# EAGLE design Rusnak2 (EAGLE 5.11)
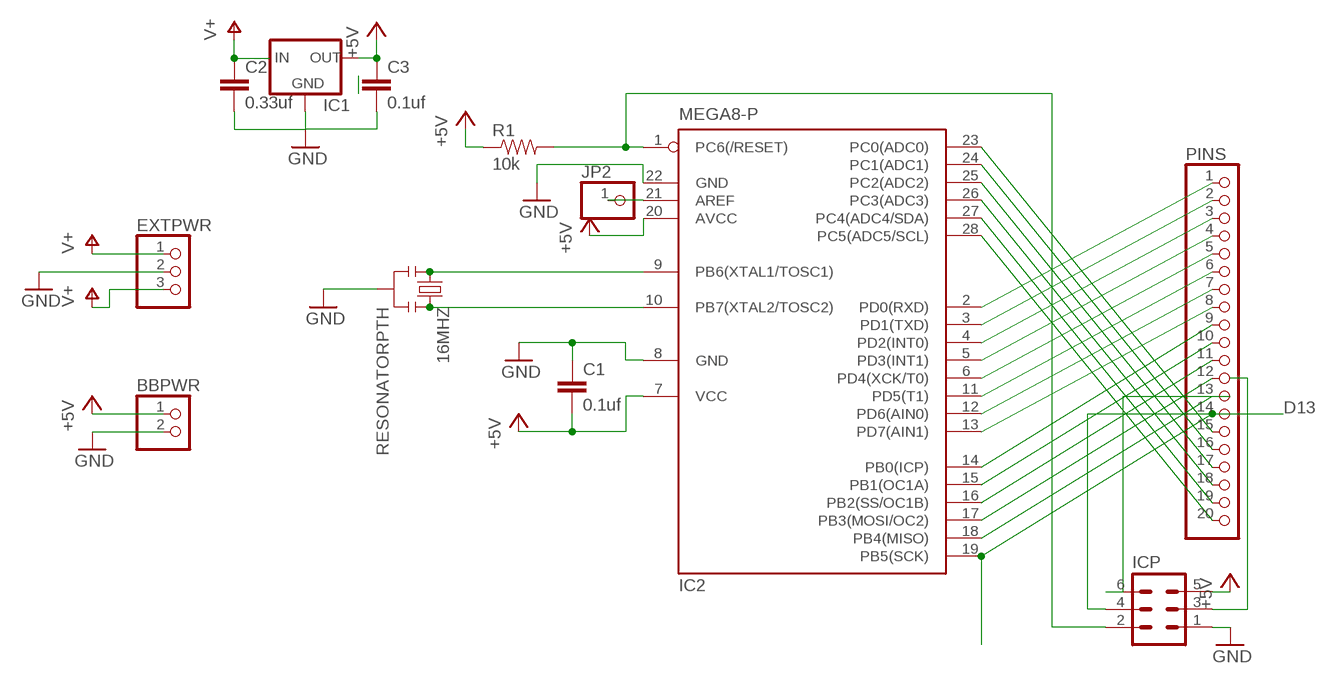
[diagram p0: schematic, sheet 1]

## Parts
16MHZ  RESONATORPTH  [RESONATOR-PTH]
BBPWR  PINHD-1X2  [1X02]
C1  0.1uf  CAP0402-CAP  [0402-CAP]
C2  0.33uf  CAP0402-CAP  [0402-CAP]
C3  0.1uf  CAP0402-CAP  [0402-CAP]
EXTPWR  PINHD-1X3  [1X03]
IC1  V_REG_78XX-TO-220  [TO-220-ALT]
IC2  MEGA8-P  [DIL28-3]
ICP  MA03-2  [MA03-2]
JP2  PINHD-1X1  [1X01]
PINS  PINHD-1X20  [1X20]
R1  10k  RESISTOR0402-RES  [0402-RES]

## Nets
+5V: BBPWR.1 C1.2 C3.1 IC1.OUT IC2.7(VCC) IC2.20(AVCC) ICP.5 R1.1
D0: IC2.2(PD0(RXD)) PINS.1
D13: IC2.19(PB5(SCK)) ICP.4 PINS.14
GND: 16MHZ.2 BBPWR.2 C1.1 C2.2 C3.2 EXTPWR.2 IC1.GND IC2.8(GND) IC2.22(GND) ICP.1
N$1: IC2.1(PC6(/RESET)) ICP.2 R1.2
N$2: IC2.21(AREF) JP2.1
N$4: 16MHZ.3 IC2.10(PB7(XTAL2/TOSC2))
N$5: 16MHZ.1 IC2.9(PB6(XTAL1/TOSC1))
N$6: IC2.28(PC5(ADC5/SCL)) PINS.20
N$7: IC2.27(PC4(ADC4/SDA)) PINS.19
N$8: IC2.26(PC3(ADC3)) PINS.18
N$9: IC2.25(PC2(ADC2)) PINS.17
N$10: IC2.24(PC1(ADC1)) PINS.16
N$11: IC2.23(PC0(ADC0)) PINS.15
N$13: IC2.3(PD1(TXD)) PINS.2
N$14: IC2.4(PD2(INT0)) PINS.3
N$15: IC2.5(PD3(INT1)) PINS.4
N$16: IC2.6(PD4(XCK/T0)) PINS.5
N$17: IC2.11(PD5(T1)) PINS.6
N$18: IC2.12(PD6(AIN0)) PINS.7
N$19: IC2.13(PD7(AIN1)) PINS.8
N$20: IC2.14(PB0(ICP)) PINS.9
N$21: IC2.15(PB1(OC1A)) PINS.10
N$22: IC2.16(PB2(SS/OC1B)) PINS.11
N$23: IC2.17(PB3(MOSI/OC2)) PINS.12
N$24: IC2.18(PB4(MISO)) PINS.13
N$27: ICP.3
N$28: ICP.6
V+: C2.1 EXTPWR.1 EXTPWR.3
Unconnected: IC1.IN

## Library data of the parts
16MHZ = SparkFun:RESONATOR: Resonator Small SMD resonator. This is the itty bitty 10/20MHz resonators with built in caps. CSTCE10M0G55 and CSTCE20M0V53. Footprint has been reviewed closely but hasn't been tested yet.
BBPWR = pinhead:PINHD-1X2: PIN HEADER
C1-C3 = SparkFun:CAP: Capacitor Standard 0603 ceramic capacitor, and 0.1" leaded capacitor.
EXTPWR = pinhead:PINHD-1X3: PIN HEADER
IC1 = SparkFun:V_REG_78XX: Voltage Regulator Standard 7805 5V regulator. IGO (Input Ground Output). Spark Fun Electronics SKU : COM-00107
IC2 = atmel:MEGA8-P: MICROCONTROLLER 8 Kbytes FLASH, 1 kbytes SRAM, 512 bytes EEPROM, USART, 4-channel 10 bit ADC, 2-channel 8 bit ADC Pin compatible with Atmega48, ATMega88, ATMega168 Source: avr.lbr; OC_FARNELL: unknown; OC_NEWARK: unknown
ICP = con-lstb:MA03-2: PIN HEADER; OC_FARNELL: unknown; OC_NEWARK: unknown
JP2 = pinhead:PINHD-1X1: PIN HEADER
PINS = pinhead:PINHD-1X20: PIN HEADER
R1 = SparkFun:RESISTOR: Resistor Basic schematic elements and footprints for 0603, 1206, and PTH resistors.

## Board
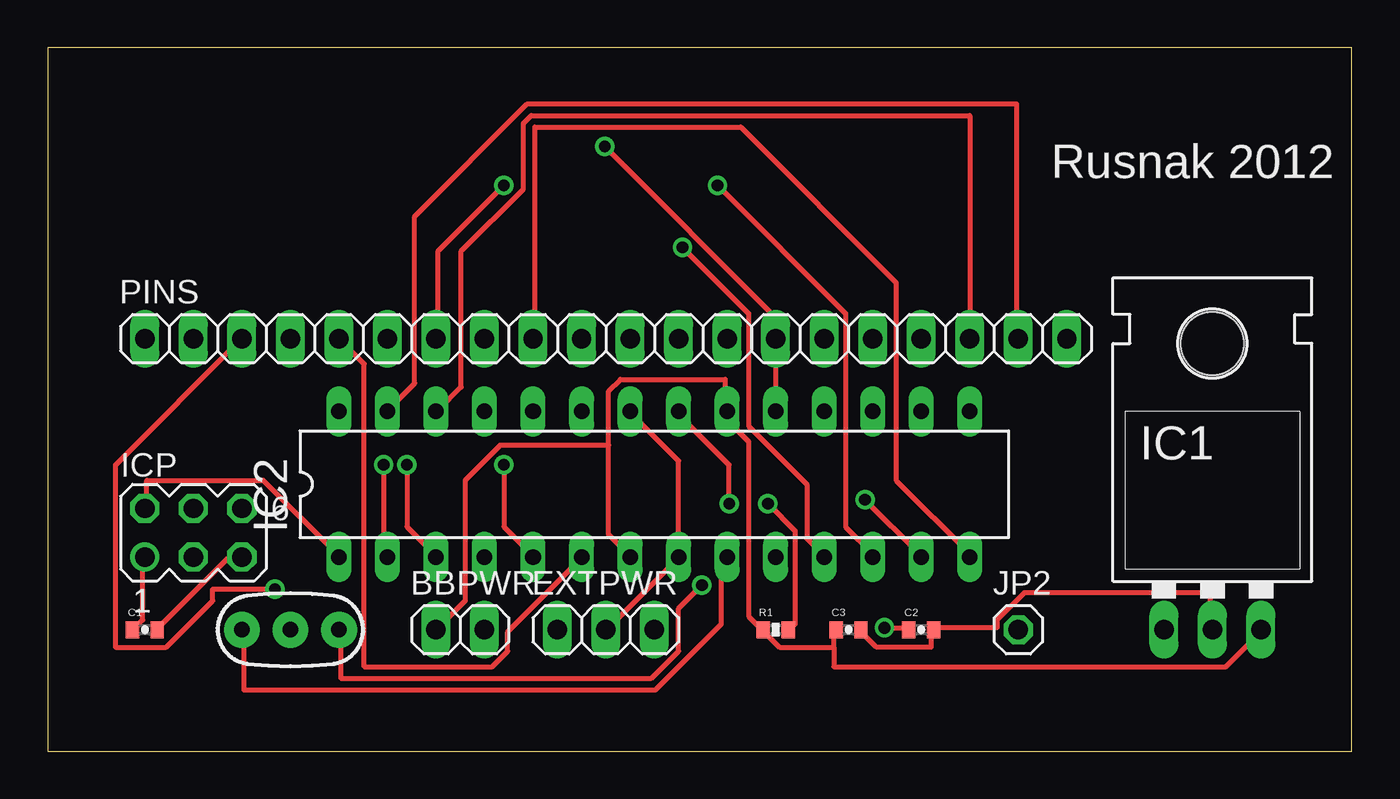
[diagram p1: board, top side]
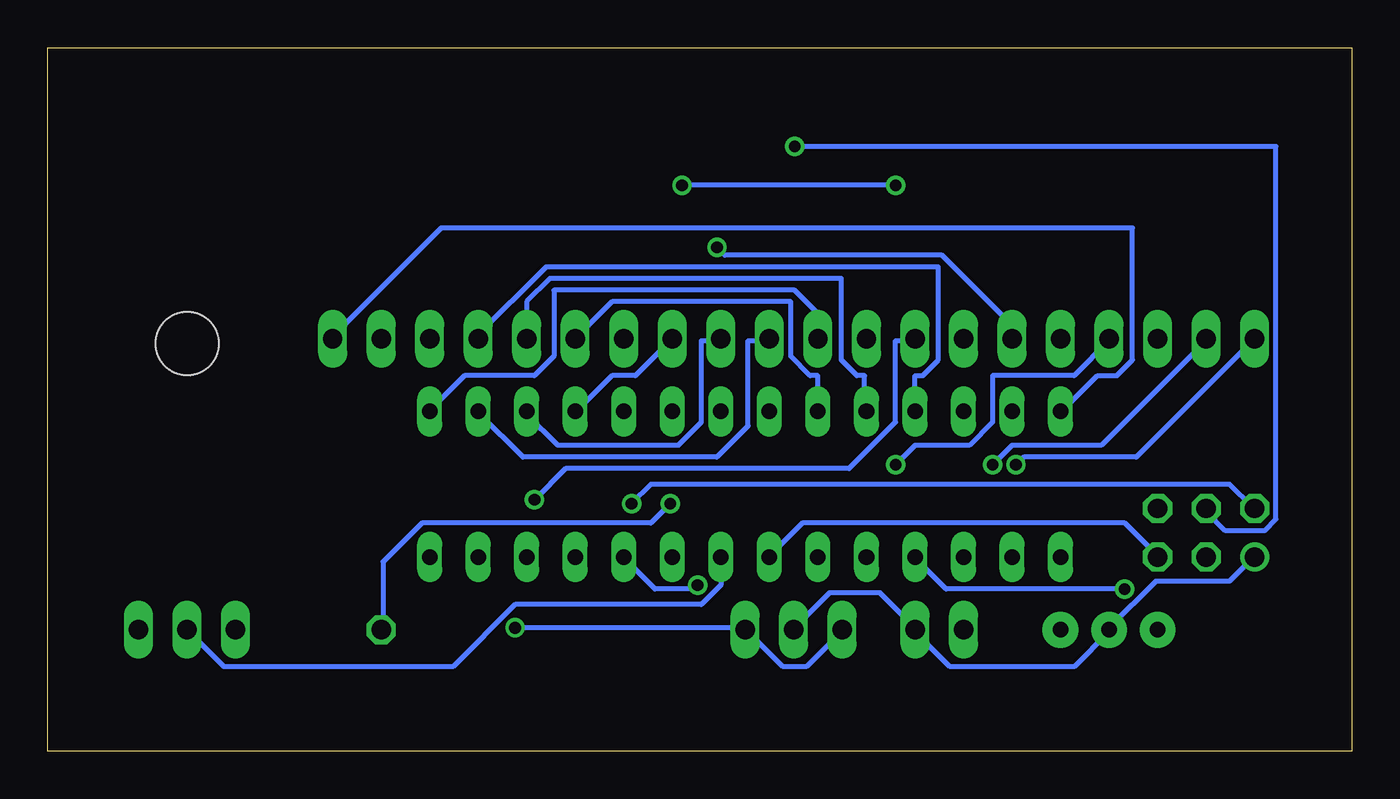
[diagram p2: board, bottom side, seen from below]

Size 68.25 x 36.82 mm. Coordinates in mm from the lower left corner, seen from the top.
Outline: 0,0 68.25,0 68.25,36.82 0,36.82 0,0
Copper layers (1*16): Top 0.035mm / dielectric 1.5mm / Bottom 0.035mm
Design rules "default": minimum track width 10mil, minimum drill 24mil, track to track 8mil, track to pad 8mil, pad to pad 8mil, via to via 8mil, smd to smd 8mil, copper to edge 40mil, drill to drill 8mil, minimum pad ring 10mil, minimum via ring 8mil, stop-mask expansion 4mil, vias tented up to drill 0mil, thermal gap 10mil

### Footprints (pad centres in the part's own frame; a part is rotated, then mirrored left to right if it is on the bottom)
RESONATOR-PTH = drill 0.8 pad 1.88 round: 1 -2.54,0; 2 0,0; 3 2.54,0
1X02 = drill 1.016 long: 1 -1.27,0; 2 1.27,0
0402-CAP = smd 0.7 x 0.9: 1 -0.65,0; 2 0.65,0
1X03 = drill 1.016 long: 1 -2.54,0; 2 0,0; 3 2.54,0
TO-220-ALT = drill 1.016 long: GND 0,-3.81; IN -2.54,-3.81; OUT 2.54,-3.81 | hole 3.302: 0,11.176
DIL28-3 = drill 0.813 long: 1 -16.51,-3.81; 2 -13.97,-3.81; 3 -11.43,-3.81; 4 -8.89,-3.81; 5 -6.35,-3.81; 6 -3.81,-3.81; 7 -1.27,-3.81; 8 1.27,-3.81; 9 3.81,-3.81; 10 6.35,-3.81; 11 8.89,-3.81; 12 11.43,-3.81; 13 13.97,-3.81; 14 16.51,-3.81; 15 16.51,3.81; 16 13.97,3.81; 17 11.43,3.81; 18 8.89,3.81; 19 6.35,3.81; 20 3.81,3.81; 21 1.27,3.81; 22 -1.27,3.81; 23 -3.81,3.81; 24 -6.35,3.81; 25 -8.89,3.81; 26 -11.43,3.81; 27 -13.97,3.81; 28 -16.51,3.81
MA03-2 = drill 1.016 round: 1 -2.54,-1.27 | drill 1.016 octagon: 2 -2.54,1.27; 3 0,-1.27; 4 0,1.27; 5 2.54,-1.27; 6 2.54,1.27
1X01 = drill 1.016 octagon: 1 0,0
1X20 = drill 1.016 long: 1 -24.13,0; 2 -21.59,0; 3 -19.05,0; 4 -16.51,0; 5 -13.97,0; 6 -11.43,0; 7 -8.89,0; 8 -6.35,0; 9 -3.81,0; 10 -1.27,0; 11 1.27,0; 12 3.81,0; 13 6.35,0; 14 8.89,0; 15 11.43,0; 16 13.97,0; 17 16.51,0; 18 19.05,0; 19 21.59,0; 20 24.13,0
0402-RES = smd 0.7 x 0.9: 1 -0.65,0; 2 0.65,0

### Placement (x,y rotation side)
16MHZ  12.7,6.35 0 top
BBPWR  21.59,6.35 0 top
C1  5.08,6.35 0 top
C2  45.72,6.35 0 top
C3  41.91,6.35 0 top
EXTPWR  29.21,6.35 0 top
IC1  60.96,10.16 0 top
IC2  31.75,13.97 0 top
ICP  7.62,11.43 0 top
JP2  50.8,6.35 0 top
PINS  29.21,21.59 0 top
R1  38.1,6.35 0 top

### Tracks (layer width: path | path; a pad name or v marks a point on that pad's centre or on a via)
+5V
  Top 0.254: C1.2 5.79,6.45 9.45,10.11 10.06,10.11 ICP.5 | 41.15,5.44 38.3,5.44 37.49,6.25 R1.1 37.29,6.45 36.68,7.06 36.68,16.2 35.66,17.22 35.66,17.63 IC2.20 35.46,17.83 35.46,19.46 29.97,19.46 29.36,18.85 29.36,16 | 41.15,5.44 41.15,6.25 C3.1 | 29.36,16 29.36,11.33 30.38,10.31 IC2.7 | 29.36,16 23.67,16 21.84,14.17 21.84,7.87 BBPWR.1 | 41.15,5.44 41.15,4.42 61.67,4.42 63.5,6.25 IC1.OUT
  Bottom 0.254: ICP.5 10.26,10.31 11.89,11.94 28.75,11.94 30.38,10.31 IC2.7
D0  (via drill 0.61)
  Top 0.254: v17.58,14.99 17.58,10.52 17.78,10.31 IC2.2
  Bottom 0.254: v17.58,14.99 17.17,15.39 11.28,15.39 PINS.1
D13  (via drill 0.61)
  Top 0.254: IC2.19 PINS.14 38.1,22.71 v29.16,31.65
  Bottom 0.254: v29.16,31.65 3.96,31.65 3.96,12.14 4.57,11.53 6.6,11.53 7.62,12.55 ICP.4
GND
  Top 0.254: C3.2 42.57,6.25 43.38,5.44 46.23,5.44 46.23,6.25 C2.2 46.43,6.45 49.68,6.45 49.68,6.86 51.1,8.28 60.86,8.28 60.86,6.45 IC1.GND | C1.1 4.57,6.45 4.98,6.86 4.98,10.11 ICP.1 | EXTPWR.2 29.36,6.45 33.02,10.11 IC2.8 33.02,15.19 30.58,17.63 IC2.22
  Bottom 0.254: ICP.1 5.18,10.11 6.4,8.89 10.26,8.89 12.7,6.45 16MHZ.2 12.7,6.25 14.53,4.42 21.03,4.42 22.86,6.25 BBPWR.2 22.86,6.45 24.69,8.28 27.33,8.28 29.16,6.45 EXTPWR.2 | IC1.GND 59.03,4.42 47.04,4.42 43.79,7.67 34.04,7.67 33.02,8.69 IC2.8
N$1  (via drill 0.61)
  Top 0.254: v37.69,12.95 39.12,11.53 39.12,6.66 38.91,6.45 R1.2 | IC2.1 15.14,10.31 11.28,14.17 5.18,14.17 5.18,12.75 ICP.2
  Bottom 0.254: v37.69,12.95 36.68,13.97 6.4,13.97 5.18,12.75 ICP.2
N$2  (via drill 0.61)
  Top 0.254: v35.66,12.95 35.66,14.99 33.02,17.63 IC2.21
  Bottom 0.254: v35.66,12.95 36.68,11.94 48.67,11.94 50.7,9.91 50.7,6.45 JP2.1
N$4  (via drill 0.61)
  Top 0.254: v34.24,8.69 33.02,7.47 33.02,5.23 31.6,3.81 15.34,3.81 15.34,6.25 16MHZ.3
  Bottom 0.254: v34.24,8.69 34.44,8.48 36.47,8.48 38.1,10.11 IC2.10
N$5
  Top 0.254: IC2.9 35.46,10.11 35.26,9.91 35.26,6.66 31.8,3.2 10.26,3.2 10.26,6.25 16MHZ.1
N$6
  Bottom 0.254: IC2.28 15.14,17.83 13.31,19.66 12.29,19.66 11.48,20.47 11.48,27.38 47.65,27.38 53.34,21.69 PINS.20
N$7
  Top 0.254: IC2.27 17.78,17.83 19.2,19.25 19.2,27.99 25.09,33.88 50.7,33.88 50.7,21.69 PINS.19
N$8
  Top 0.254: IC2.26 20.42,17.83 21.64,19.05 21.64,26.16 24.89,29.41 24.89,32.87 25.3,33.27 48.26,33.27 PINS.18
N$9
  Bottom 0.254: IC2.25 22.86,19.66 22.45,19.66 21.64,20.47 21.64,25.35 42.16,25.35 45.82,21.69 PINS.17
N$10
  Bottom 0.254: IC2.24 25.5,17.83 25.5,19.66 25.91,19.66 26.72,20.47 26.72,24.74 41.96,24.74 43.18,23.52 PINS.16
N$11
  Bottom 0.254: IC2.23 27.94,19.66 28.35,19.66 29.36,20.68 29.36,23.52 38.71,23.52 PINS.15
N$13  (via drill 0.61)
  Top 0.254: v18.8,14.99 18.8,11.73 20.22,10.31 IC2.3
  Bottom 0.254: v18.8,14.99 17.78,16 13.11,16 7.62,21.49 PINS.2
N$14  (via drill 0.61)
  Top 0.254: v11.89,8.48 8.64,8.48 8.64,7.87 6.2,5.44 3.56,5.44 3.56,14.99 PINS.3
  Bottom 0.254: v11.89,8.48 21.23,8.48 22.86,10.11 IC2.4
N$15  (via drill 0.61)
  Top 0.254: v23.88,14.99 23.88,11.73 25.3,10.31 IC2.5
  Bottom 0.254: v23.88,14.99 22.86,16 20.02,16 18.8,17.22 18.8,19.66 14.53,19.66 12.7,21.49 PINS.4
N$16
  Top 0.254: IC2.6 27.94,10.11 24.08,6.25 24.08,5.23 23.27,4.42 16.56,4.42 16.56,20.27 PINS.5
N$17  (via drill 0.61)
  Top 0.254: v33.22,26.36 36.68,22.91 36.68,17.02 39.73,13.97 39.73,11.12 40.54,10.31 IC2.11
  Bottom 0.254: v33.22,26.36 32.82,25.96 21.44,25.96 17.78,22.3 PINS.6
N$18  (via drill 0.61)
  Top 0.254: v35.05,29.62 41.76,22.91 41.76,11.73 43.18,10.31 IC2.12 | v23.88,29.62 20.42,26.16 20.42,21.69 PINS.7
  Bottom 0.254: v23.88,29.62 v35.05,29.62
N$19  (via drill 0.61)
  Top 0.254: v42.77,13.16 45.62,10.31 IC2.13
  Bottom 0.254: v42.77,13.16 41.15,14.78 26.31,14.78 23.88,17.22 23.88,21.49 22.86,21.49 PINS.8
N$20
  Top 0.254: IC2.14 48.26,10.31 44.4,14.17 44.4,24.54 36.27,32.66 25.5,32.66 25.5,21.69 PINS.9
N$21
  Bottom 0.254: IC2.15 48.26,17.83 46.43,19.66 42.77,19.66 41.76,20.68 41.76,24.13 29.16,24.13 27.94,22.91 PINS.10
N$22
  Bottom 0.254: IC2.16 45.62,17.63 43.38,15.39 33.22,15.39 31.6,17.02 31.6,21.49 30.58,21.49 PINS.11
N$23
  Bottom 0.254: IC2.17 43.18,17.63 41.55,16 35.26,16 34.04,17.22 34.04,21.49 33.02,21.49 PINS.12
N$24
  Bottom 0.254: IC2.18 40.54,17.83 38.71,19.66 37.49,19.66 PINS.13
V+  (via drill 0.61)
  Top 0.254: v43.79,6.45 45.01,6.45 C2.1
  Bottom 0.254: v43.79,6.45 31.8,6.45 EXTPWR.3 31.6,6.25 29.77,4.42 28.55,4.42 26.72,6.25 EXTPWR.1

### Text on the board
tPlace: Rusnak 2012